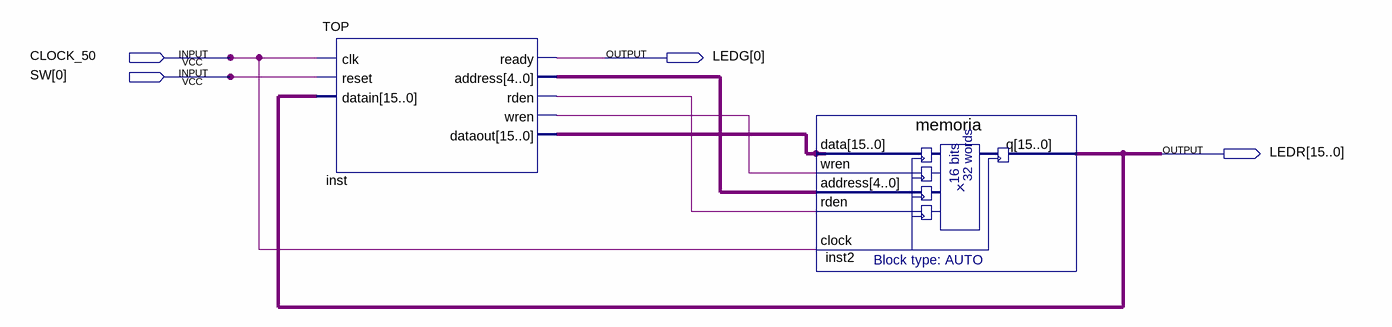
[diagram p0: schematic sheet]
// Quartus schematic Somador16.bdf as structural Verilog: 2 symbols, 4 pins
module Somador16 (
  input  CLOCK_50,
  input  [0:0] SW,
  output [0:0] LEDG,
  output [15:0] LEDR
);

  wire inst_rden, inst_wren;
  wire [4:0] inst_address;
  wire [15:0] inst_dataout;

  TOP inst (
    .clk(CLOCK_50), .reset(SW[0]), .datain(LEDR), .ready(LEDG[0]), .address(inst_address), .rden(inst_rden),
    .wren(inst_wren), .dataout(inst_dataout));
  memoria inst2 (
    .data(inst_dataout), .wren(inst_wren), .address(inst_address), .rden(inst_rden), .clock(CLOCK_50),
    .q(LEDR));
endmodule
